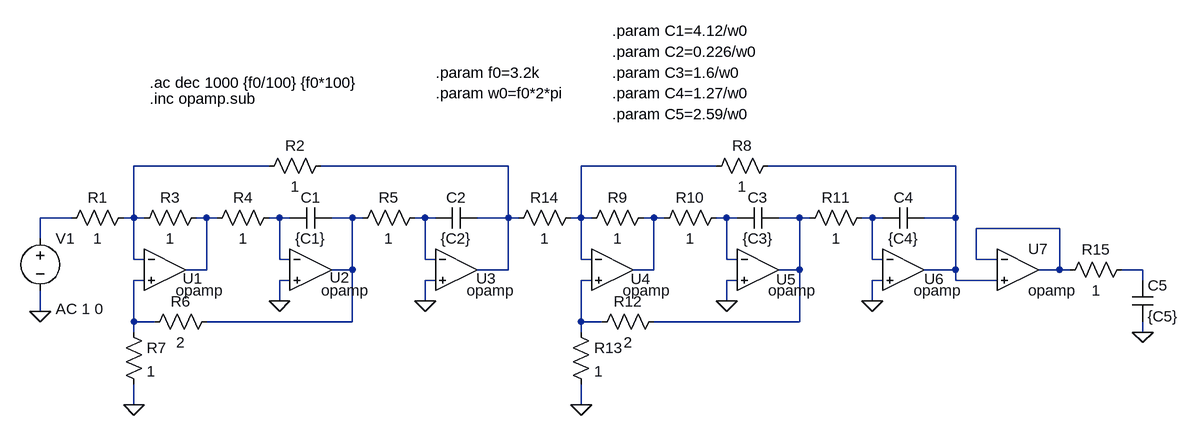
[diagram p0: schematic EJ3.asc]
EJ3.asc, the LTspice schematic file:
Version 4
SHEET 1 1684 680
WIRE 272 32 64 32
WIRE 640 32 352 32
WIRE 960 32 752 32
WIRE 1328 32 1040 32
WIRE -32 112 -80 112
WIRE 64 112 64 32
WIRE 64 112 48 112
WIRE 80 112 64 112
WIRE 176 112 160 112
WIRE 192 112 176 112
WIRE 288 112 272 112
WIRE 304 112 288 112
WIRE 400 112 368 112
WIRE 416 112 400 112
WIRE 512 112 496 112
WIRE 528 112 512 112
WIRE 640 112 640 32
WIRE 640 112 592 112
WIRE 656 112 640 112
WIRE 752 112 752 32
WIRE 752 112 736 112
WIRE 768 112 752 112
WIRE 864 112 848 112
WIRE 880 112 864 112
WIRE 976 112 960 112
WIRE 992 112 976 112
WIRE 1088 112 1056 112
WIRE 1104 112 1088 112
WIRE 1200 112 1184 112
WIRE 1216 112 1200 112
WIRE 1328 112 1328 32
WIRE 1328 112 1280 112
WIRE 1488 128 1360 128
WIRE -80 144 -80 112
WIRE 64 176 64 112
WIRE 80 176 64 176
WIRE 288 176 288 112
WIRE 304 176 288 176
WIRE 512 176 512 112
WIRE 528 176 512 176
WIRE 752 176 752 112
WIRE 768 176 752 176
WIRE 976 176 976 112
WIRE 992 176 976 176
WIRE 1200 176 1200 112
WIRE 1216 176 1200 176
WIRE 1360 176 1360 128
WIRE 1392 176 1360 176
WIRE 176 192 176 112
WIRE 176 192 144 192
WIRE 400 192 400 112
WIRE 400 192 368 192
WIRE 640 192 640 112
WIRE 640 192 592 192
WIRE 864 192 864 112
WIRE 864 192 832 192
WIRE 1088 192 1088 112
WIRE 1088 192 1056 192
WIRE 1328 192 1328 112
WIRE 1328 192 1280 192
WIRE 1488 192 1488 128
WIRE 1488 192 1456 192
WIRE 1504 192 1488 192
WIRE 1616 192 1584 192
WIRE 80 208 64 208
WIRE 304 208 288 208
WIRE 528 208 512 208
WIRE 768 208 752 208
WIRE 992 208 976 208
WIRE 1216 208 1200 208
WIRE 1328 208 1328 192
WIRE 1392 208 1328 208
WIRE 1616 208 1616 192
WIRE 288 240 288 208
WIRE 512 240 512 208
WIRE 976 240 976 208
WIRE 1200 240 1200 208
WIRE -80 256 -80 224
WIRE 64 272 64 208
WIRE 96 272 64 272
WIRE 400 272 400 192
WIRE 400 272 176 272
WIRE 752 272 752 208
WIRE 784 272 752 272
WIRE 1088 272 1088 192
WIRE 1088 272 864 272
WIRE 64 288 64 272
WIRE 752 288 752 272
WIRE 1616 288 1616 272
WIRE 64 400 64 368
WIRE 752 400 752 368
FLAG 512 240 0
FLAG 288 240 0
FLAG 64 400 0
FLAG -80 256 0
FLAG 1200 240 0
FLAG 976 240 0
FLAG 752 400 0
FLAG 1616 288 0
SYMBOL voltage -80 128 R0
WINDOW 123 24 124 Left 2
WINDOW 39 0 0 Left 0
SYMATTR Value2 AC 1 0
SYMATTR InstName V1
SYMATTR Value ""
SYMBOL Opamps\\opamp 112 128 R0
WINDOW 0 27 77 Left 2
SYMATTR InstName U1
SYMBOL Opamps\\opamp 336 128 R0
WINDOW 0 29 76 Left 2
SYMATTR InstName U2
SYMBOL Opamps\\opamp 560 128 R0
WINDOW 0 31 77 Left 2
SYMATTR InstName U3
SYMBOL cap 368 96 R90
WINDOW 0 0 32 VBottom 2
WINDOW 3 32 32 VTop 2
SYMATTR InstName C1
SYMATTR Value {C1}
SYMBOL cap 592 96 R90
WINDOW 0 0 32 VBottom 2
WINDOW 3 32 32 VTop 2
SYMATTR InstName C2
SYMATTR Value {C2}
SYMBOL res 64 96 R90
WINDOW 0 0 56 VBottom 2
WINDOW 3 32 56 VTop 2
SYMATTR InstName R1
SYMATTR Value 1
SYMBOL res 368 16 R90
WINDOW 0 0 56 VBottom 2
WINDOW 3 32 56 VTop 2
SYMATTR InstName R2
SYMATTR Value 1
SYMBOL res 176 96 R90
WINDOW 0 0 56 VBottom 2
WINDOW 3 32 56 VTop 2
SYMATTR InstName R3
SYMATTR Value 1
SYMBOL res 288 96 R90
WINDOW 0 0 56 VBottom 2
WINDOW 3 32 56 VTop 2
SYMATTR InstName R4
SYMATTR Value 1
SYMBOL res 512 96 R90
WINDOW 0 0 56 VBottom 2
WINDOW 3 32 56 VTop 2
SYMATTR InstName R5
SYMATTR Value 1
SYMBOL res 80 288 R270
WINDOW 0 32 56 VTop 2
WINDOW 3 0 56 VBottom 2
SYMATTR InstName R6
SYMATTR Value 2
SYMBOL res 48 272 R0
SYMATTR InstName R7
SYMATTR Value 1
SYMBOL Opamps\\opamp 800 128 R0
WINDOW 0 28 78 Left 2
SYMATTR InstName U4
SYMBOL Opamps\\opamp 1024 128 R0
WINDOW 0 28 79 Left 2
SYMATTR InstName U5
SYMBOL Opamps\\opamp 1248 128 R0
WINDOW 0 32 78 Left 2
SYMATTR InstName U6
SYMBOL cap 1056 96 R90
WINDOW 0 0 32 VBottom 2
WINDOW 3 32 32 VTop 2
SYMATTR InstName C3
SYMATTR Value {C3}
SYMBOL cap 1280 96 R90
WINDOW 0 0 32 VBottom 2
WINDOW 3 32 32 VTop 2
SYMATTR InstName C4
SYMATTR Value {C4}
SYMBOL res 1056 16 R90
WINDOW 0 0 56 VBottom 2
WINDOW 3 32 56 VTop 2
SYMATTR InstName R8
SYMATTR Value 1
SYMBOL res 864 96 R90
WINDOW 0 0 56 VBottom 2
WINDOW 3 32 56 VTop 2
SYMATTR InstName R9
SYMATTR Value 1
SYMBOL res 976 96 R90
WINDOW 0 0 56 VBottom 2
WINDOW 3 32 56 VTop 2
SYMATTR InstName R10
SYMATTR Value 1
SYMBOL res 1200 96 R90
WINDOW 0 0 56 VBottom 2
WINDOW 3 32 56 VTop 2
SYMATTR InstName R11
SYMATTR Value 1
SYMBOL res 768 288 R270
WINDOW 0 32 56 VTop 2
WINDOW 3 0 56 VBottom 2
SYMATTR InstName R12
SYMATTR Value 2
SYMBOL res 736 272 R0
SYMATTR InstName R13
SYMATTR Value 1
SYMBOL res 752 96 R90
WINDOW 0 0 56 VBottom 2
WINDOW 3 32 56 VTop 2
SYMATTR InstName R14
SYMATTR Value 1
SYMBOL Opamps\\opamp 1424 128 R0
SYMATTR InstName U7
SYMBOL res 1600 176 R90
WINDOW 0 0 56 VBottom 2
WINDOW 3 32 56 VTop 2
SYMATTR InstName R15
SYMATTR Value 1
SYMBOL cap 1600 208 R0
SYMATTR InstName C5
SYMATTR Value {C5}
TEXT 88 -72 Left 2 !.inc opamp.sub
TEXT 88 -96 Left 2 !.ac dec 1000 {f0/100} {f0*100}
TEXT 800 -176 Left 2 !.param C1=4.12/w0
TEXT 800 -144 Left 2 !.param C2=0.226/w0
TEXT 800 -112 Left 2 !.param C3=1.6/w0
TEXT 800 -80 Left 2 !.param C4=1.27/w0
TEXT 528 -80 Left 2 !.param w0=f0*2*pi
TEXT 528 -112 Left 2 !.param f0=3.2k
TEXT 800 -48 Left 2 !.param C5=2.59/w0

The netlist it stands for:
* EJ3.asc
V1 N005 0 AC 1 0
XU1 N001 N016 N006 opamp Aol=100K GBW=10Meg  ; pins invin noninvin out
XU2 N007 0 N008 opamp Aol=100K GBW=10Meg  ; pins invin noninvin out
XU3 N009 0 N002 opamp Aol=100K GBW=10Meg  ; pins invin noninvin out
C1 N008 N007 {C1}
C2 N002 N009 {C2}
R1 N001 N005 1
R2 N002 N001 1
R3 N006 N001 1
R4 N007 N006 1
R5 N009 N008 1
R6 N016 N008 2
R7 N016 0 1
XU4 N003 N017 N010 opamp Aol=100K GBW=10Meg  ; pins invin noninvin out
XU5 N011 0 N012 opamp Aol=100K GBW=10Meg  ; pins invin noninvin out
XU6 N013 0 N004 opamp Aol=100K GBW=10Meg  ; pins invin noninvin out
C3 N012 N011 {C3}
C4 N004 N013 {C4}
R8 N004 N003 1
R9 N010 N003 1
R10 N011 N010 1
R11 N013 N012 1
R12 N017 N012 2
R13 N017 0 1
R14 N003 N002 1
XU7 N014 N004 N014 opamp Aol=100K GBW=10Meg  ; pins invin noninvin out
R15 N015 N014 1
C5 N015 0 {C5}
.inc opamp.sub
.ac dec 1000 {f0/100} {f0*100}
.param C1=4.12/w0
.param C2=0.226/w0
.param C3=1.6/w0
.param C4=1.27/w0
.param w0=f0*2*pi
.param f0=3.2k
.param C5=2.59/w0
.backanno
.end